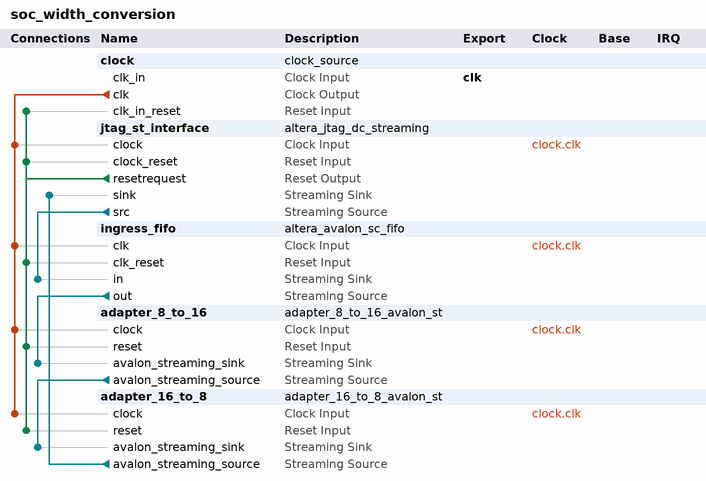
[diagram p0: system contents]
# Platform Designer (Qsys) system soc_width_conversion, Cyclone V 5CSXFC6C6U23C8ES
# Parameters at their usual value, and those the tool derives, are not listed.
package require -exact qsys 13.1
create_system soc_width_conversion
set_project_property DEVICE_FAMILY {Cyclone V}
set_project_property DEVICE 5CSXFC6C6U23C8ES

add_instance clock clock_source 13.1
set_instance_parameter_value clock clockFrequency 50000000

add_instance jtag_st_interface altera_jtag_dc_streaming 13.1
set_instance_parameter_value jtag_st_interface PURPOSE 0
set_instance_parameter_value jtag_st_interface UPSTREAM_FIFO_SIZE 0
set_instance_parameter_value jtag_st_interface DOWNSTREAM_FIFO_SIZE 0
set_instance_parameter_value jtag_st_interface MGMT_CHANNEL_WIDTH -1
set_instance_parameter_value jtag_st_interface USE_PLI 0
set_instance_parameter_value jtag_st_interface PLI_PORT 50000
set_instance_parameter_value jtag_st_interface USE_DOWNSTREAM_READY 0
set_instance_parameter_value jtag_st_interface COMPONENT_CLOCK 50000000
set_instance_parameter_value jtag_st_interface FABRIC 2.0

add_instance ingress_fifo altera_avalon_sc_fifo 13.1
set_instance_parameter_value ingress_fifo BITS_PER_SYMBOL 8
set_instance_parameter_value ingress_fifo FIFO_DEPTH 16
set_instance_parameter_value ingress_fifo CHANNEL_WIDTH 0
set_instance_parameter_value ingress_fifo ERROR_WIDTH 0
set_instance_parameter_value ingress_fifo USE_FILL_LEVEL 0
set_instance_parameter_value ingress_fifo USE_MEMORY_BLOCKS 1
set_instance_parameter_value ingress_fifo USE_STORE_FORWARD 0

add_instance adapter_8_to_16 adapter_8_to_16_avalon_st 1.0

add_instance adapter_16_to_8 adapter_16_to_8_avalon_st 1.0

# connections
add_connection clock.clk adapter_8_to_16.clock clock
add_connection clock.clk adapter_16_to_8.clock clock
add_connection clock.clk ingress_fifo.clk clock
add_connection clock.clk jtag_st_interface.clock clock
add_connection jtag_st_interface.resetrequest adapter_8_to_16.reset reset
add_connection jtag_st_interface.resetrequest adapter_16_to_8.reset reset
add_connection jtag_st_interface.resetrequest clock.clk_in_reset reset
add_connection jtag_st_interface.resetrequest ingress_fifo.clk_reset reset
add_connection jtag_st_interface.resetrequest jtag_st_interface.clock_reset reset
add_connection adapter_8_to_16.avalon_streaming_source adapter_16_to_8.avalon_streaming_sink avalon_streaming
add_connection adapter_16_to_8.avalon_streaming_source jtag_st_interface.sink avalon_streaming
add_connection ingress_fifo.out adapter_8_to_16.avalon_streaming_sink avalon_streaming
add_connection jtag_st_interface.src ingress_fifo.in avalon_streaming

# exported interfaces
add_interface clk clock sink
set_interface_property clk EXPORT_OF clock.clk_in

set_interconnect_requirement {$system} qsys_mm.clockCrossingAdapter HANDSHAKE
set_interconnect_requirement {$system} qsys_mm.maxAdditionalLatency 1
set_interconnect_requirement {$system} qsys_mm.insertDefaultSlave false

save_system soc_width_conversion.qsys
